# Altium project Arduino Cape.PrjPcb
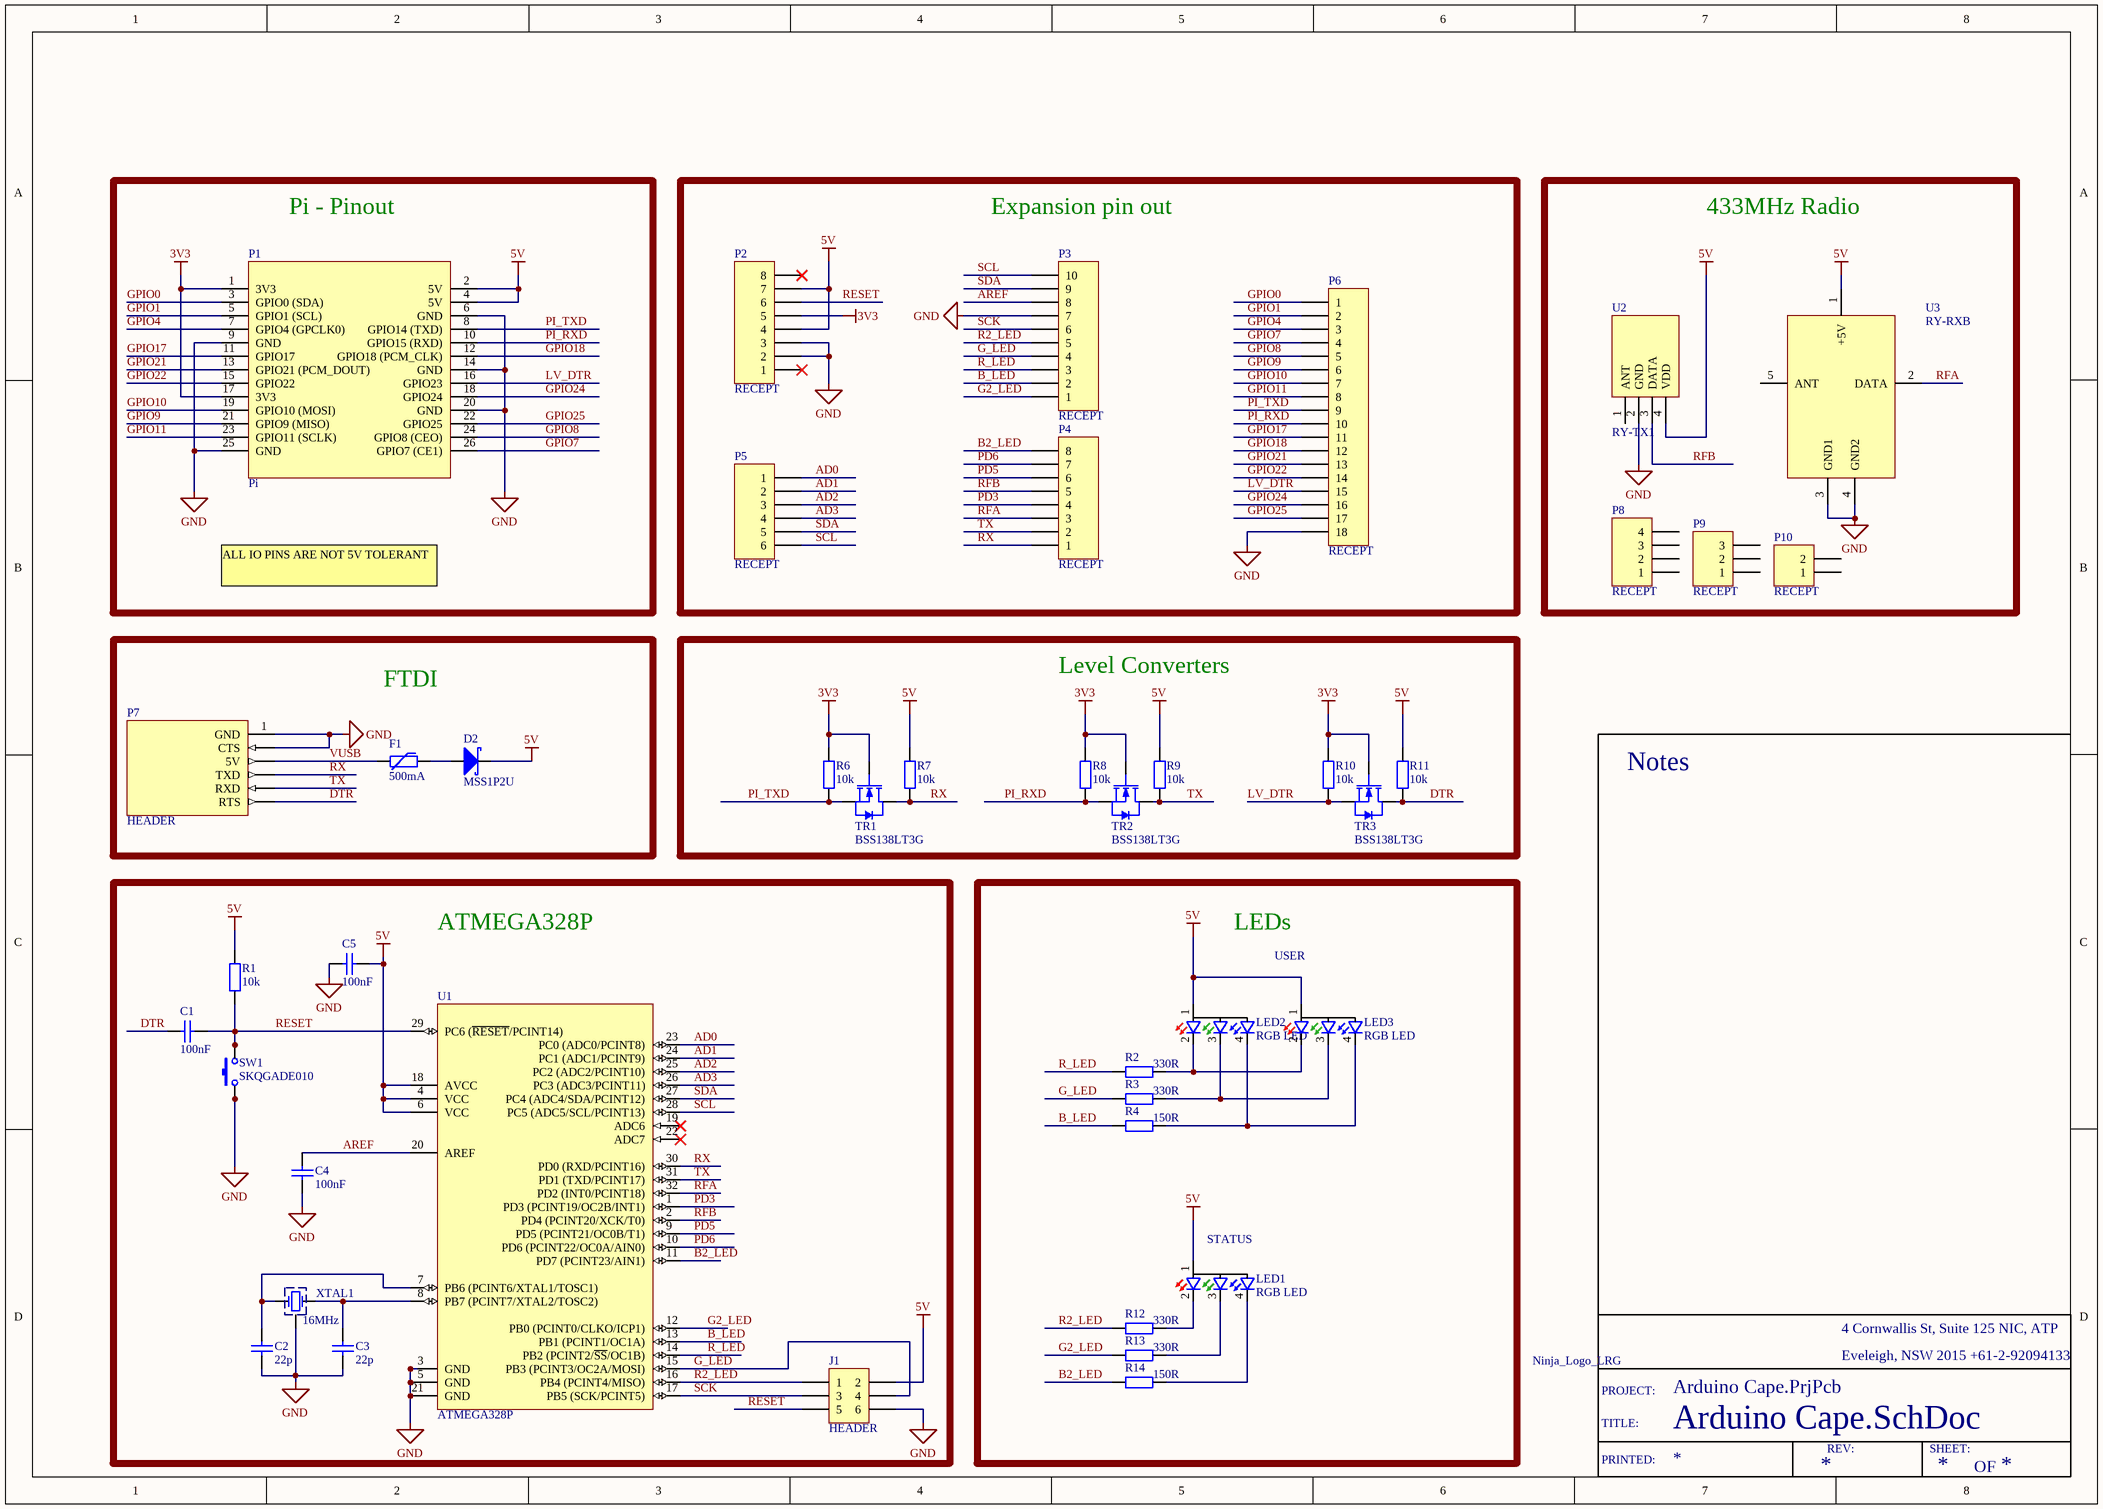
[diagram p0: Arduino Cape.SchDoc]
1 sheet, 45 parts. Net scope: global (net labels, ports and power ports of the same name join across sheets).
Board file: Arduino Cape.PcbDoc

## Sheet Arduino Cape.SchDoc
size A3

### Parts
?  (no value)  (graphical)
C1  100nF  [CAPC1608N]
C2  22p  [CAPC1608N]
C3  22p  [CAPC1608N]
C4  100nF  [CAPC1608N]
C5  100nF  [CAPC1608N]
D2  MSS1P2U  [MICROSMP]
F1  500mA  [L1812]
J1  HEADER  [MA03-2]  (no BOM)
LED1  RGB LED  [AVAGO_RGB_LED]
LED2  RGB LED  [AVAGO_RGB_LED]
LED3  RGB LED  [AVAGO_RGB_LED]
Ninja  Ninja_Logo_LRG  [NinjaBlocks_LRG]  (no BOM)
OpenHardware  OpenHardware_logo  [OpenHardware_logo]  (value not drawn)  (no BOM)
P1  Pi  [SIP13X.2]
P2  RECEPT  [Header 8x1 8.5mm]
P3  RECEPT  [Header 10x1 8.5mm]
P4  RECEPT  [Header 8x1 8.5mm]
P5  RECEPT  [Header 6x1 8.5mm]
P6  RECEPT  [SIP18X.1]
P7  HEADER  [SIP6X.1]  (no BOM)
P8  RECEPT  [Header 4x1 8.5mm]  (mechanical)
P9  RECEPT  [Header 3x1 8.5mm]  (mechanical)
P10  RECEPT  [Header 2x1 8.5mm]  (mechanical)
R1  10k  [RESC1608N]
R2  330R  [RESC1608N]
R3  330R  [RESC1608N]
R4  150R  [RESC1608N]
R6  10k  [RESC1608N]
R7  10k  [RESC1608N]
R8  10k  [RESC1608N]
R9  10k  [RESC1608N]
R10  10k  [RESC1608N]
R11  10k  [RESC1608N]
R12  330R  [RESC1608N]
R13  330R  [RESC1608N]
R14  150R  [RESC1608N]
SW1  SKQGADE010  [ALPS_SMD_TAC_SWITCH]
TR1  BSS138LT3G  [SOT-23]
TR2  BSS138LT3G  [SOT-23]
TR3  BSS138LT3G  [SOT-23]
U1  ATMEGA328P  [32A_M]
U2  RY-TX1  [TX1]  (no BOM)
U3  RY-RXB  [RXB8]  (no BOM)
XTAL1  16MHz  [HC49US-G]

### Blocks framed on the sheet
Pi - Pinout: P1
Expansion pin out: P2-P6
433MHz Radio: P8-P10 U2 U3
FTDI: D2 F1 P7
Level Converters: R6-R11 TR1-TR3
ATMEGA328P: C1-C5 J1 R1 SW1 U1 XTAL1
LEDs: LED1-LED3 R2-R4 R12-R14

### Nets
3V3: P1.1(3V3) P1.17(3V3) P2.5 R6.2 R8.2 R10.2 TR1.1(G) TR2.1(G) TR3.1(G)
5V: C5.1 D2.2(K) J1.2 LED1.1(A1) LED2.1(A1) LED3.1(A1) P1.2(5V) P1.4(5V) P2.4 P2.7 R1.2 R7.2 R9.2 R11.2 U1.4(VCC) U1.6(VCC) U1.18(AVCC) U2.4(VDD) U3.1(+5V)
GND: C2.1 C3.1 C4.1 C5.2 J1.6 P1.6(GND) P1.9(GND) P1.14(GND) P1.20(GND) P1.25(GND) P2.2 P2.3 P3.7 P6.18 P7.1(GND) P7.2(CTS) SW1.1 SW1.2 U1.3(GND) U1.5(GND) U1.21(GND) U2.2(GND) U3.3(GND1) U3.4(GND2) XTAL1.2(case)
AD0: P5.1 U1.23(PC0_(ADC0/PCINT8))
AD1: P5.2 U1.24(PC1_(ADC1/PCINT9))
AD2: P5.3 U1.25(PC2_(ADC2/PCINT10))
AD3: P5.4 U1.26(PC3_(ADC3/PCINT11))
AREF: C4.2 P3.8 U1.20(AREF)
B2_LED: P4.8 R14.2 U1.11(PD7_(PCINT23/AIN1))
B_LED: P3.2 R4.2 U1.13(PB1_(PCINT1/OC1A))
DTR: C1.1 P7.6(RTS) R11.1 TR3.3(D)
G2_LED: P3.1 R13.1 U1.12(PB0_(PCINT0/CLKO/ICP1))
G_LED: J1.4 P3.4 R3.1 U1.15(PB3_(PCINT3/OC2A/MOSI))
GPIO0: P1.3(GPIO0_(SDA)) P6.1
GPIO1: P1.5(GPIO1_(SCL)) P6.2
GPIO4: P1.7(GPIO4_(GPCLK0)) P6.3
GPIO7: P1.26(GPIO7_(CE1)) P6.4
GPIO8: P1.24(GPIO8_(CEO)) P6.5
GPIO9: P1.21(GPIO9_(MISO)) P6.6
GPIO10: P1.19(GPIO10_(MOSI)) P6.7
GPIO11: P1.23(GPIO11_(SCLK)) P6.8
GPIO17: P1.11(GPIO17) P6.11
GPIO18: P1.12(GPIO18_(PCM_CLK)) P6.12
GPIO21: P1.13(GPIO21_(PCM_DOUT)) P6.13
GPIO22: P1.15(GPIO22) P6.14
GPIO24: P1.18(GPIO24) P6.16
GPIO25: P1.22(GPIO25) P6.17
LV_DTR: P1.16(GPIO23) P6.15 R10.1 TR3.2(S)
PD3: P4.4 U1.1(PD3_(PCINT19/OC2B/INT1))
PD5: P4.6 U1.9(PD5_(PCINT21/OC0B/T1))
PD6: P4.7 U1.10(PD6_(PCINT22/OC0A/AIN0))
PI_RXD: P1.10(GPIO15_(RXD)) P6.10 R8.1 TR2.2(S)
PI_TXD: P1.8(GPIO14_(TXD)) P6.9 R6.1 TR1.2(S)
R2_LED: J1.1 P3.5 R12.1 U1.16(PB4_(PCINT4/MISO))
R_LED: P3.3 R2.1 U1.14(PB2_(PCINT2/~{SS}/OC1B))
RESET: C1.2 J1.5 P2.6 R1.1 SW1.3 SW1.4 U1.29(PC6_(~{RESET}/PCINT14))
RFA: P4.3 U1.32(PD2_(INT0/PCINT18)) U3.2(DATA)
RFB: P4.5 U1.2(PD4_(PCINT20/XCK/T0)) U2.3(DATA)
RX: P4.1 P7.4(TXD) R7.1 TR1.3(D) U1.30(PD0_(RXD/PCINT16))
SCK: J1.3 P3.6 U1.17(PB5_(SCK/PCINT5))
SCL: P3.10 P5.6 U1.28(PC5_(ADC5/SCL/PCINT13))
SDA: P3.9 P5.5 U1.27(PC4_(ADC4/SDA/PCINT12))
TX: P4.2 P7.5(RXD) R9.1 TR2.3(D) U1.31(PD1_(TXD/PCINT17))
VUSB: F1.1 P7.3(5V)
NetC2_2: C2.2 U1.7(PB6_(PCINT6/XTAL1/TOSC1)) XTAL1.1(OSC1)
NetC3_2: C3.2 U1.8(PB7_(PCINT7/XTAL2/TOSC2)) XTAL1.3(OSC2)
NetD2_1: D2.1(A) F1.2
NetLED1_2: LED1.2(R2) R12.2
NetLED1_3: LED1.3(G3) R13.2
NetLED1_4: LED1.4(B4) R14.1
NetLED2_2: LED2.2(R2) LED3.2(R2) R2.2
NetLED2_3: LED2.3(G3) LED3.3(G3) R3.2
NetLED2_4: LED2.4(B4) LED3.4(B4) R4.1

Not connected (* = marked no-connect by the designer): P2 1* 8*; P8 1 2 3 4; P9 1 2 3; P10 1 2; U1 19(ADC6)* 22(ADC7)*; U2 1(ANT); U3 5(ANT)

### Notes on the sheet
- ALL IO PINS ARE NOT 5V TOLERANT
- USER
- (near LED1) STATUS
- Notes
- 4 Cornwallis St, Suite 125 NIC, ATP
- PROJECT:
- Eveleigh, NSW 2015 +61-2-92094133
- TITLE:
- PRINTED:
- REV:
- SHEET:
- OF

### Library data of the parts
? = Sch_IPC_TitleBlock_A4_1: Standard LX Schematic Title Block IPC
C1 C4 C5 = 1088: CAP 100nF CER 50V 10% X7R 0603 SMD; Manufacturer: Murata; Checked: False; MFG P/N: GRM188R71H104KA93D; Numeric: 1.00E-07; Type: Capacitor; LXPN: 1088; HelpURL: X:\Datasheets\Murata\Ceramic Caps GR.pdf; Main Value: 100nF; Package: 0603; Supplier 1: Digi-Key; Supplier Part Number 1: 490-1519-1-ND; Tolerance: 10%; Voltage-rated: 50V
C2 C3 = 2235: CAP CER 22PF 5% 50V NP0 0603; Manufacturer: AVX; MFG P/N: 06035A220JAT2A; Numeric: 2,2E-11; Tolerance: 0,05; Type: Capacitor; HelpURL: X:\Datasheets\AVX\C0G(NP0).pdf; Main Value: 22p; Package: 0603; Supplier 1: Digi-Key; Supplier Part Number 1: 478-1167-1-ND; Voltage-rated: 50V
D2 = 4286: DIODE SCHOTTKY MSS1P2U 20V 1A; Manufacturer: Vishay; MFG P/N: MSS1P2U-M3/89A; Current-rated: 1A; HelpURL: X:\Datasheets\Vishay\MSS1P2U.pdf; Main Value: MSS1P2U; Supplier 1: Mouser; Supplier Part Number 1: 625-MSS1P2U-M3; Type: Diode; Voltage-rated: 20V
F1 = 4288: PTC RESETTABLE 1812L050PR 15V 500mA 1812; Manufacturer: LittelFuse; Main Value: 15V 500A; Current-rated: 500A; HelpURL: X:\Datasheets\LittelFuse\1812L050PR.pdf; MFG P/N: 1812L050PR; Package: 1812; Supplier 1: Digi-Key; Supplier Part Number 1: F2150CT-ND; Voltage-rated: 15V; Type: PTC
J1 = 4300: CONN HEADER 2 row 6pos 2.54mm spacing Vertical TH; Manufacturer: FCI; MFG P/N: 67996-406HLF; Current-rated: 2.54mm; HelpURL: X:\Datasheets\FCI\67996-406HLF.pdf; Main Value: HEADER; Numeric: 6pos; Supplier 1: Digi-Key; Supplier Part Number 1: 609-3218-ND; Type: Connector
LED1-LED3 = 4289: LED HSMF-C118 20mA RGB SMD; Manufacturer: Avago; Current-rated: 20mA; HelpURL: X:\Datasheets\Avago\AV02-0610EN.pdf; Main Value: RGB; MFG P/N: HSMF-C118; Supplier 1: Digi-Key; Supplier Part Number 1: 516-1778-1-ND; Type: LED
OpenHardware = OpenHardware_logo: Open Hardware Logo
P1 = 4280: TALL FEMALE 13x2 HEADER; Manufacturer: Samtec; Main Value: 13x2 Way; MFG P/N: ESQ-113-23-T-D; Package: SIP13X.2; Supplier 1: Samtec; Supplier Part Number 1: ESQ-113-23-T-D; Type: Connector
P2 P4 = 4298: CONN RECEPT Female 8pos 2.54mm spacing Vertical TH; Manufacturer: Sullins; MFG P/N: PPTC081LFBN; HelpURL: X:\Datasheets\3M\960108.pdf; Main Value: RECEPT; Supplier 1: Digi-Key; Supplier Part Number 1: S4008-ND; Type: Connector; Current-rated: 2.54mm; Numeric: 8pos
P3 = 4297: CONN RECEPT Female 10pos 2.54mm spacing Vertical TH; Manufacturer: Sullins; MFG P/N: PPPC101LFBN-RC; HelpURL: X:\Datasheets\TE Connectivity\ENG_CD_534237_R4.pdf; Main Value: RECEPT; Supplier 1: Digi-Key; Supplier Part Number 1: S7043-ND; Type: Connector; Current-rated: 2.54mm; Numeric: 10pos
P5 = 4299: CONN RECEPT Female 6pos 2.54mm spacing Vertical TH; Manufacturer: Sullins; MFG P/N: PPTC061LFBN-RC; HelpURL: X:\Datasheets\TE Connectivity\ENG_CD_534237_R4.pdf; Main Value: RECEPT; Supplier 1: Digi-Key; Supplier Part Number 1: S7004-ND; Type: Connector; Current-rated: 2.54mm; Numeric: 6pos
P6 = 4302: CONN RECEPT Female 18pos 2.54mm spacing Vertical TH; Manufacturer: Sullins; MFG P/N: PPTC181LFBN-RC; Current-rated: 2.54mm; HelpURL: X:\Datasheets\TE Connectivity\ENG_CD_535541_N5.pdf; Main Value: RECEPT; Numeric: 18pos; Supplier 1: Digi-Key; Supplier Part Number 1: S7016-ND; Type: Connector
P7 = 4016: CONN HEADER FTDI Connector 6pos 2.54mm spacing Vertical TH HDR1X6; Manufacturer: FCI; MFG P/N: 68000-206HLF; Current-rated: 2.54mm; HelpURL: X:\Datasheets\FCI\6way Header.pdf; Supplier 1: Digi-Key; Supplier Part Number 1: 609-3256-ND; Main Value: HEADER; Numeric: 6pos; Package: HDR1X6; Type: Connector
P8 = 4492: CONN RECEPT Female 4pos 2.54mm spacing Vertical TH; Manufacturer: Sullins; MFG P/N: PPPC041LFBN-RC; Current-rated: 2.54mm; HelpURL: X:\Datasheets\Sullins\PPPC021LFBN.pdf; Main Value: RECEPT; Numeric: 4pos; Supplier 1: Digi-Key; Supplier Part Number 1: S7037-ND; Type: Connector
P9 = 4491: CONN RECEPT Female 3pos 2.54mm spacing Vertical TH; Manufacturer: Sullins; MFG P/N: PPPC031LFBN-RC; Current-rated: 2.54mm; HelpURL: X:\Datasheets\Sullins\PPPC021LFBN.pdf; Main Value: RECEPT; Numeric: 3pos; Supplier 1: Digi-Key; Supplier Part Number 1: S7036-ND; Type: Connector
P10 = 4490: CONN RECEPT Female 2pos 2.54mm spacing Vertical TH; Manufacturer: Sullins; MFG P/N: PPPC021LFBN-RC; Current-rated: 2.54mm; HelpURL: X:\Datasheets\Sullins\PPPC021LFBN.pdf; Main Value: RECEPT; Numeric: 2pos; Supplier 1: Digi-Key; Supplier Part Number 1: S7035-ND; Type: Connector
R1 R6-R11 = 1382: RES 10k OHM 1/10W 1% 0603 SMD; Manufacturer: Yageo; Checked: False; MFG P/N: RC0603FR-0710KL; Numeric: 1.00E+04; LXPN: 1382; Main Value: 10k; Package: 0603; Supplier 1: Digi-Key; Supplier Part Number 1: 311-10.0KHRCT-ND; Tolerance: 1%; Type: Resistor
R2 R3 R12 R13 = 2087: RES 330 OHM 1/10W 1% 0603 SMD; Manufacturer: Yageo; Checked: False; MFG P/N: RC0603FR-07330RL; Tolerance: 0,01; Numeric: 3.30E+02; LXPN: 2087; HelpURL: X:\Datasheets\Yageo\RC0603 Series Resistors.pdf; Main Value: 330R; Package: 0603; Supplier 1: Digi-Key; Supplier Part Number 1: 311-330HRCT-ND; Type: Resistor
R4 R14 = 4119: RES 150 OHM 0.1W 1% 0603 SMD; Manufacturer: Yageo; MFG P/N: RC0603FR-07150RL; Numeric: 1.50E+02; Main Value: 150R; Package: 0603; Supplier 1: Digi-Key; Supplier Part Number 1: 311-150HRCT-ND; Tolerance: 1%; Type: Resistor; LXPN: 4119
SW1 = 4290: Switch Tactile SKQGADE010 SPST SMD; Manufacturer: Alps; HelpURL: X:\Datasheets\Alps\SKQGADE010.pdf; Main Value: SKQGADE010; MFG P/N: SKQGADE010; Supplier 1: Farnell; Supplier Part Number 1: 1656434; Type: SWITCH
TR1-TR3 = 4287: MOSFET N BSS138LT3G 50V 200mA SOT-23; Manufacturer: ON Semiconductor; Current-rated: 200mA; HelpURL: X:\Datasheets\ON Semiconductor\BSS138LT3G.pdf; Main Value: BSS138LT3G; MFG P/N: BSS138LT3G; Package: SOT-23; Supplier 1: Digi-Key; Supplier Part Number 1: BSS138LT3GOSCT-ND; Type: Mosfet N; Voltage-rated: 50V
U1 = 4292: IC MCU ATMEGA328P 32K FLASH 32TQFP; Manufacturer: Atmel; MFG P/N: ATMEGA328P-AU; HelpURL: X:\Datasheets\Atmel\ATMEGA328P-AU.pdf; Main Value: ATMEGA328P; Package: 32TQFP; Supplier 1: Digi-Key; Supplier Part Number 1: ATMEGA328P-AU-ND; Type: MCU
U2 = 4294: Module RF RY-TX1 Transmitting Module Through-hole; Main Value: RY-TX1; Supplier 1: Ninja Blocks; Supplier Part Number 1: RY-TX1; Type: Module
U3 = 4293: Module RF RY-RXB Receiving Module Through-hole; Main Value: RY-RXB; Supplier 1: Ninja Blocks; Supplier Part Number 1: RY-RXB; Type: Module
XTAL1 = 4291: XTAL 16.000MHz 18pF +/-20ppm tol HC49/USSMD; Manufacturer: Abracon; MFG P/N: ABLSG-16.000MHZ-D-2-Y-T; HelpURL: X:\Datasheets\Abracon\ABLSG.pdf; Main Value: 16.000MHZ; Package: HC49/US; Supplier 1: Digi-Key; Supplier Part Number 1: 535-10617-1-ND; Tolerance: +/-20ppm; Type: Crystal